# Altium schematic sheet 180Micro_TopLevel.SchDoc
size A4
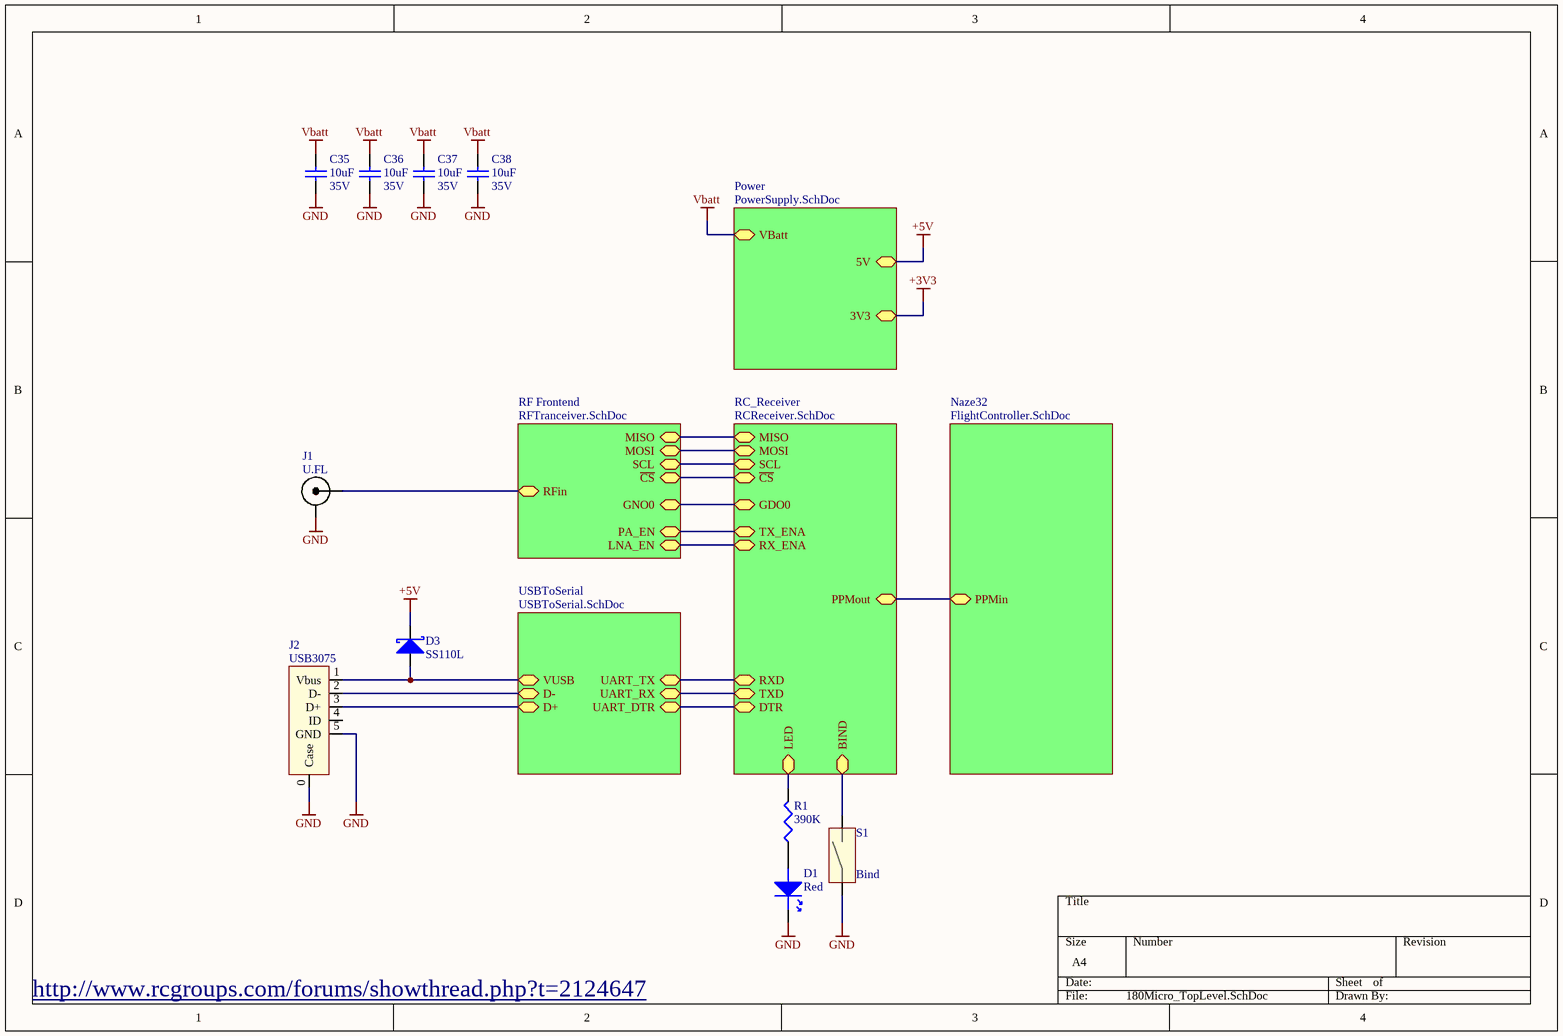
[diagram p0: 180Micro_TopLevel.SchDoc]

## Parts
C35  10uF  Voltage Rating: 35V
C36  10uF  Voltage Rating: 35V
C37  10uF  Voltage Rating: 35V
C38  10uF  Voltage Rating: 35V
D1  Red  [D-0805]
D3  SS110L  [SUB-SMA]
J1  U.FL  [U_FL]
J2  USB3075  [USB3075]
R1  390K  [0603]
S1  Bind  [KSS]

## Sub-sheets
Naze32 = FlightController.SchDoc: PPMin
Power = PowerSupply.SchDoc: 5V, 3V3, VBatt
RC_Receiver = RCReceiver.SchDoc: PPMout, RXD, TXD, DTR, MISO, MOSI, SCL, ~{CS}, BIND, LED, RX_ENA, TX_ENA, GDO0
RF Frontend = RFTranceiver.SchDoc: RFin, MISO, MOSI, SCL, ~{CS}, PA_EN, LNA_EN, GNO0
USBToSerial = USBToSerial.SchDoc: VUSB, UART_RX, UART_DTR, D-, D+, UART_TX

## Nets
+3V3: sheet Power/3V3
+5V: D3.2(K) ; sheet Power/5V
GND: C35.1 C36.1 C37.1 C38.1 D1.K J1.0(GND) J2.0(Case) J2.5(GND) S1.1
Vbatt: C35.2 C36.2 C37.2 C38.2 ; sheet Power/VBatt
NetD1_A: D1.A R1.1
NetD3_1: D3.1(A) J2.1(Vbus) ; sheet USBToSerial/VUSB
NetJ1_1: J1.1 ; sheet RF Frontend/RFin
NetJ2_2: J2.2(D-) ; sheet USBToSerial/D-
NetJ2_3: J2.3(D+) ; sheet USBToSerial/D+
NetR1_2: R1.2 ; sheet RC_Receiver/LED
NetS1_2: S1.2 ; sheet RC_Receiver/BIND
(unnamed): sheet RC_Receiver/PPMout, sheet Naze32/PPMin
(unnamed): sheet RC_Receiver/RXD, sheet USBToSerial/UART_TX
(unnamed): sheet RC_Receiver/TXD, sheet USBToSerial/UART_RX
(unnamed): sheet RC_Receiver/DTR, sheet USBToSerial/UART_DTR
(unnamed): sheet RC_Receiver/MISO, sheet RF Frontend/MISO
(unnamed): sheet RC_Receiver/MOSI, sheet RF Frontend/MOSI
(unnamed): sheet RC_Receiver/SCL, sheet RF Frontend/SCL
(unnamed): sheet RC_Receiver/~{CS}, sheet RF Frontend/~{CS}
(unnamed): sheet RC_Receiver/RX_ENA, sheet RF Frontend/LNA_EN
(unnamed): sheet RC_Receiver/TX_ENA, sheet RF Frontend/PA_EN
(unnamed): sheet RC_Receiver/GDO0, sheet RF Frontend/GNO0

Not connected (* = marked no-connect by the designer): J2 4(ID)

## Notes on the sheet
- http://www.rcgroups.com/forums/showthread.php?t=2124647

## Library data of the parts
C35-C38 = 10uF/1206/CER/35V: Capacitor, 10uF, 35V, X5R; Dielectric Characteristic: *; Capacitance: 10uF; Capacitance Tolerance: *; Capacitor Case Style: *; Temperature Range: *; Brand Number: *; Brand: *; Price: 0,27; Order Code Supplier: 1797011; Supplier: Farnell
D1 = SML-211UTT86K: Led, Red, Li:2.5mcd, Vf:1.8V, If:0.02A; Brand: ROHM; Case Style: 0805; Forward Current: 0.02A; Forward Voltage: 1.8V; Luminous Intensity: 2.5mcd; Brand Number: SML-211UTT86K; Order Code Supplier: 1685056RL; Price: 0,29; Supplier: Farnell; Temperature Range: -30°C to +85°C
D3 = SS110L: Diode Schottky, Vrrm: 100V, If: 1A, Vf: 0.9V; Brand: TAIWAN SEMICONDUCTOR; Case Style: SMF; Brand Number: SS110L; Forward Current: 1A; Forward Voltage: 0.9V; Order Code Supplier: 1559156; Price: 0,191; Supplier: Farnell; Temperature Range: -55°C to +150°C; Vrrm: 100V
J1 = U.FL-R-SMT: Connector RF Coax; Brand: Hiroze; Brand Number: U.FL-R-SMT(01); Case Style: U_FL; Order Code Supplier: 3908021; Price: 1,53; Supplier: Farnell
J2 = USB3075: USB 2.0 MICRO B, RCPT, 5POS, SMT; Brand: Global Connector Technology; Brand Number: USB3075-30-A; Case Style: Micro B SMT; Pitch: 0.8mm; Order Code Supplier: 2443116; Price: 0,313; Supplier: Farnell
R1 = 390K/0603/0100W/75V: Resistor, 390K, 1%, 0.1W, 75V, 50PPM, 0603; Brand: VISHAY DRALORIC; Brand Number: CRCW0603390KFKEA; Case Style: 0603; Order Code Supplier: 2122692; Power Rating: 0.1W; Price: 0,145; Resistance: 390K; Supplier: Farnell; Temperature Coefficient: ± 50PPM; Temperature Range: -55°C to +125°C; Voltage Rating: 75V
S1 = KSS341G LFS: Switch, Tactile, SPNO, DC:32V, DC:50mA; Brand: C & K COMPONENTS; Brand Number: KSS341G LFS; Price: 0,42; Order Code Supplier: 1201408; Supplier: Farnell